# EAGLE design psu (EAGLE 7.7.0)
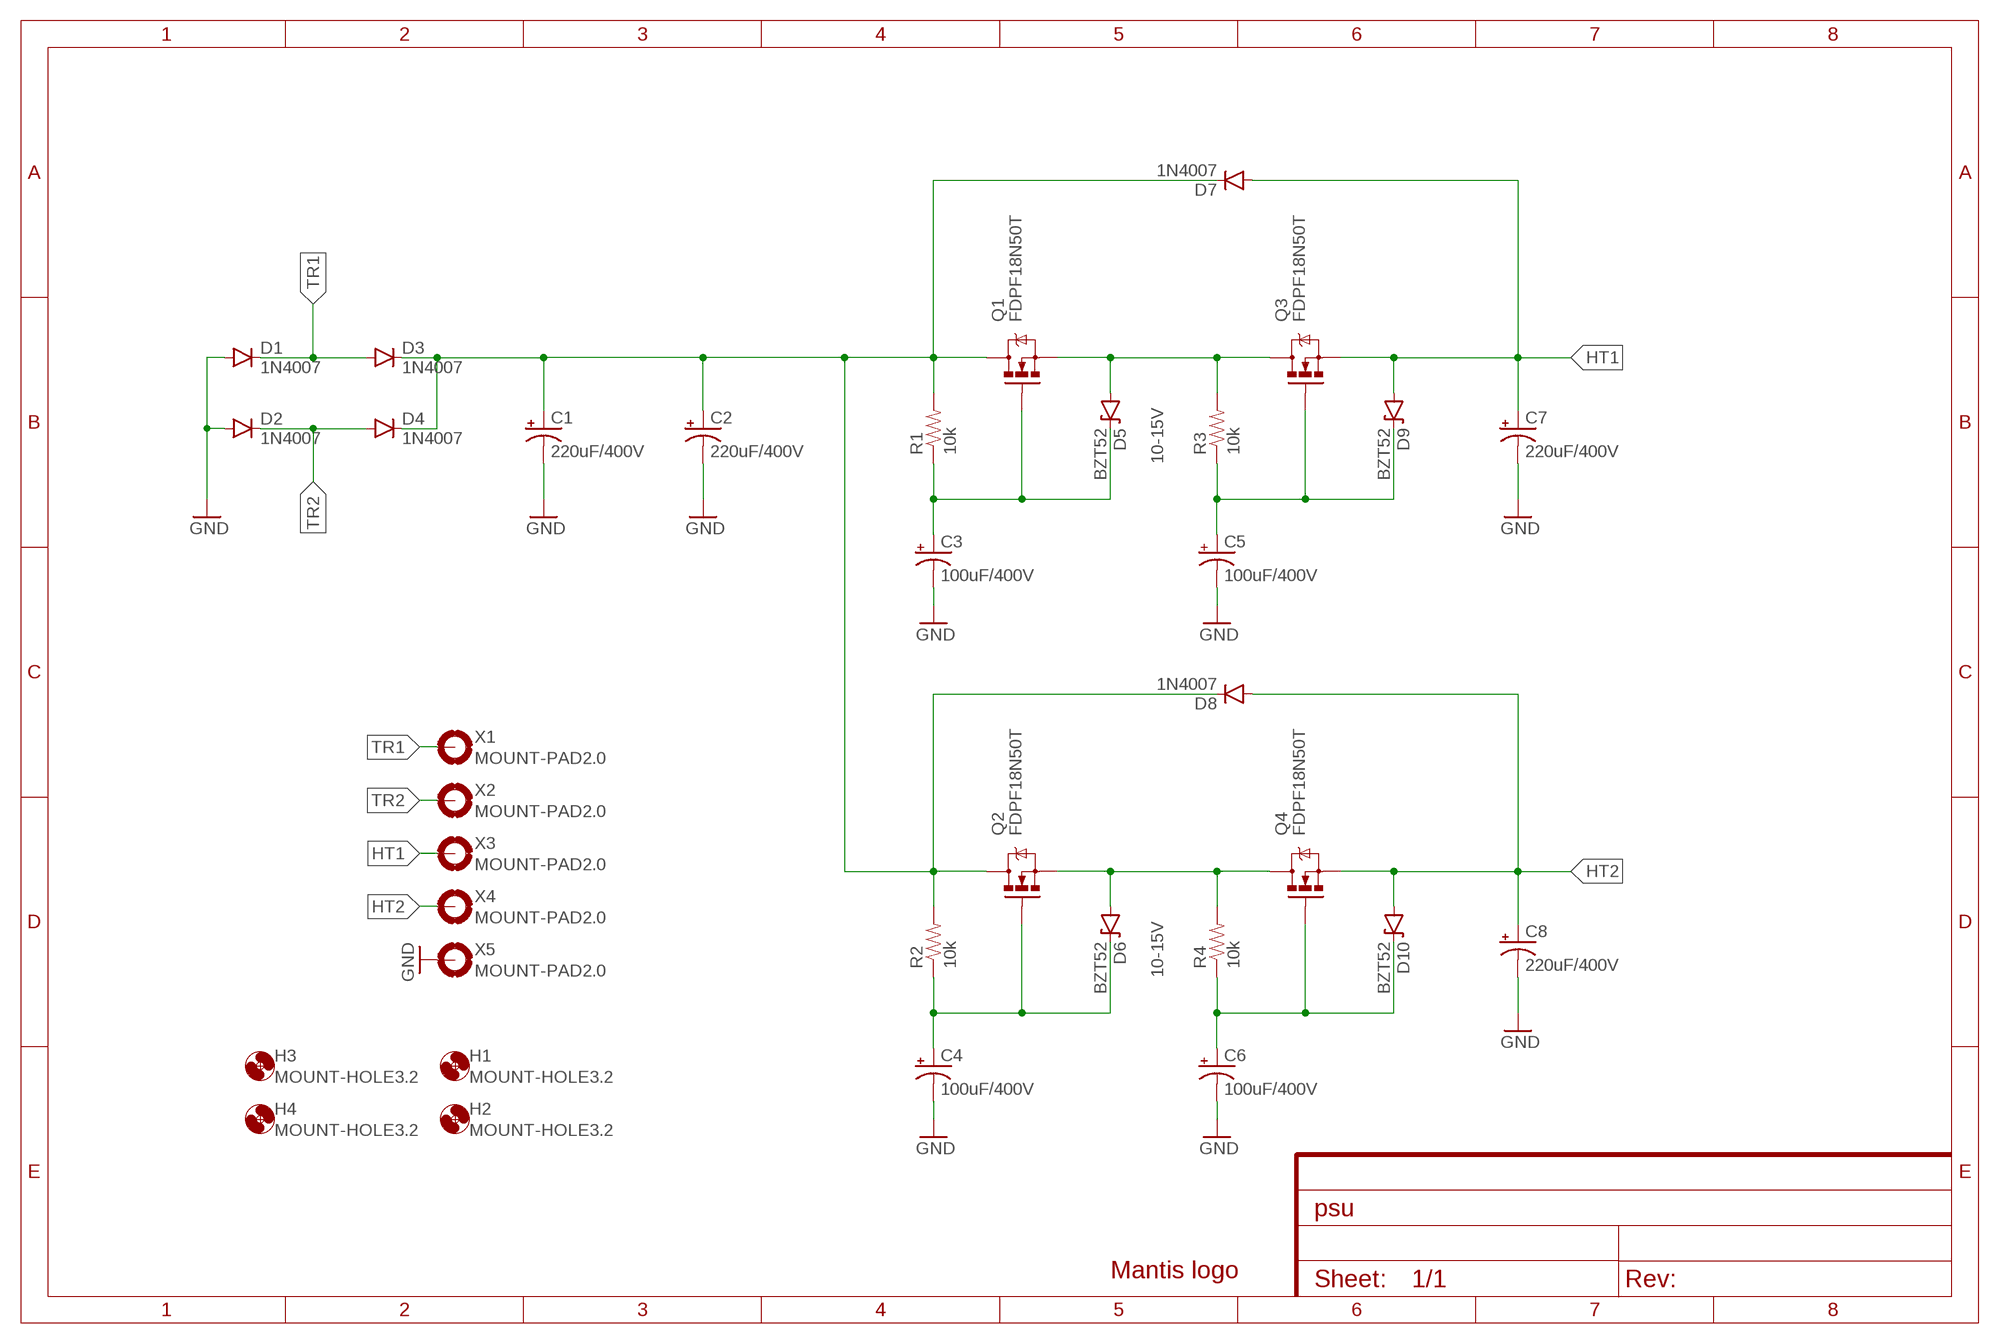
[diagram p0: schematic, sheet 1]

## Parts
C1  220uF/400V  CAP_POLPTH-25/12.5  [CPOL-RADIAL-25/12.5]
C2  220uF/400V  CAP_POLPTH-25/12.5  [CPOL-RADIAL-25/12.5]
C3  100uF/400V  CAP_POLPTH-16/7.5  [CPOL-RADIAL-16/7.5]
C4  100uF/400V  CAP_POLPTH-16/7.5  [CPOL-RADIAL-16/7.5]
C5  100uF/400V  CAP_POLPTH-16/7.5  [CPOL-RADIAL-16/7.5]
C6  100uF/400V  CAP_POLPTH-16/7.5  [CPOL-RADIAL-16/7.5]
C7  220uF/400V  CAP_POLPTH-25/12.5  [CPOL-RADIAL-25/12.5]
C8  220uF/400V  CAP_POLPTH-25/12.5  [CPOL-RADIAL-25/12.5]
D1  1N4007  DIODEPTH  [DIODE-1N4001]
D2  1N4007  DIODEPTH  [DIODE-1N4001]
D3  1N4007  DIODEPTH  [DIODE-1N4001]
D4  1N4007  DIODEPTH  [DIODE-1N4001]
D5  BZT52  DIODE-ZENER  [DIODE-BZT52]
D6  BZT52  DIODE-ZENER  [DIODE-BZT52]
D7  1N4007  DIODEPTH  [DIODE-1N4001]
D8  1N4007  DIODEPTH  [DIODE-1N4001]
D9  BZT52  DIODE-ZENER  [DIODE-BZT52]
D10  BZT52  DIODE-ZENER  [DIODE-BZT52]
H1  MOUNT-HOLE3.2  [3,2]
H2  MOUNT-HOLE3.2  [3,2]
H3  MOUNT-HOLE3.2  [3,2]
H4  MOUNT-HOLE3.2  [3,2]
LOGO1  LOGO-MANTIS  [LOGO-MANTIS]
Q1  FDPF18N50T  [TO220V]
Q2  FDPF18N50T  [TO220V]
Q3  FDPF18N50T  [TO220V]
Q4  FDPF18N50T  [TO220V]
R1  10k  RESISTORPTH-1/4W  [AXIAL-0.4]
R2  10k  RESISTORPTH-1/4W  [AXIAL-0.4]
R3  10k  RESISTORPTH-1/4W  [AXIAL-0.4]
R4  10k  RESISTORPTH-1/4W  [AXIAL-0.4]
X1  MOUNT-PAD2.0  [2.0-PAD]
X2  MOUNT-PAD2.0  [2.0-PAD]
X3  MOUNT-PAD2.0  [2.0-PAD]
X4  MOUNT-PAD2.0  [2.0-PAD]
X5  MOUNT-PAD2.0  [2.0-PAD]

## Nets
GND: C1.2(-) C2.2(-) C3.2(-) C4.2(-) C5.2(-) C6.2(-) C7.2(-) C8.2(-) D1.A D2.A X5.P$1(MOUNT)
HT1: C7.1(+) D7.A D9.A Q3.3(S) X3.P$1(MOUNT)
HT2: C8.1(+) D8.A D10.A Q4.3(S) X4.P$1(MOUNT)
N$1: C1.1(+) C2.1(+) D3.C D4.C D7.C D8.C Q1.2(D) Q2.2(D) R1.P$2 R2.P$2
N$2: C3.1(+) D5.C Q1.1(G) R1.P$1
N$3: D5.A Q1.3(S) Q3.2(D) R3.P$2
N$5: C5.1(+) D9.C Q3.1(G) R3.P$1
N$6: C4.1(+) D6.C Q2.1(G) R2.P$1
N$7: D6.A Q2.3(S) Q4.2(D) R4.P$2
N$8: C6.1(+) D10.C Q4.1(G) R4.P$1
TR1: D1.C D3.A X1.P$1(MOUNT)
TR2: D2.C D4.A X2.P$1(MOUNT)

## Notes on the sheet
- 10-15V
- 10-15V

## Library data of the parts
C1-C8 = my-cap:CAP_POL: Capacitor Polarized These are standard SMD and PTH capacitors. Normally 10uF, 47uF, and 100uF in electrolytic and tantalum varieties. Always verify the external diameter of the through hole cap, it varies with capacity, voltage, and manufacturer. The EIA devices should be standard.
D1-D4 D7 D8 = SparkFun-DiscreteSemi:DIODE: Diode These are standard reverse protection diodes and small signal diodes. SMA package can handle up to about 1A. SOD-323 can handle about 200mA. What the SOD-323 package when ordering, there are some mfgs out there that are 5-pin packages.
D5 D6 D9 D10 = SparkFun-DiscreteSemi:DIODE-ZENER: Zener Diode Production Part - 8199 3.4V Zener Voltage; PROD-ID: DIO-08199
H1-H4 = holes:MOUNT-HOLE: MOUNTING HOLE with drill center marker
LOGO1 = my:LOGO-MANTIS: Mantis logo
Q1-Q4 = my-tran:FDPF18N50T: MOSFET 500V N-Channel PowerTrench MOSFET
R1-R4 = my-res:RESISTOR: Resistor Basic schematic elements and footprints for 0603, 1206, and PTH resistors.
X1-X5 = my-conn:MOUNT-PAD

## Board
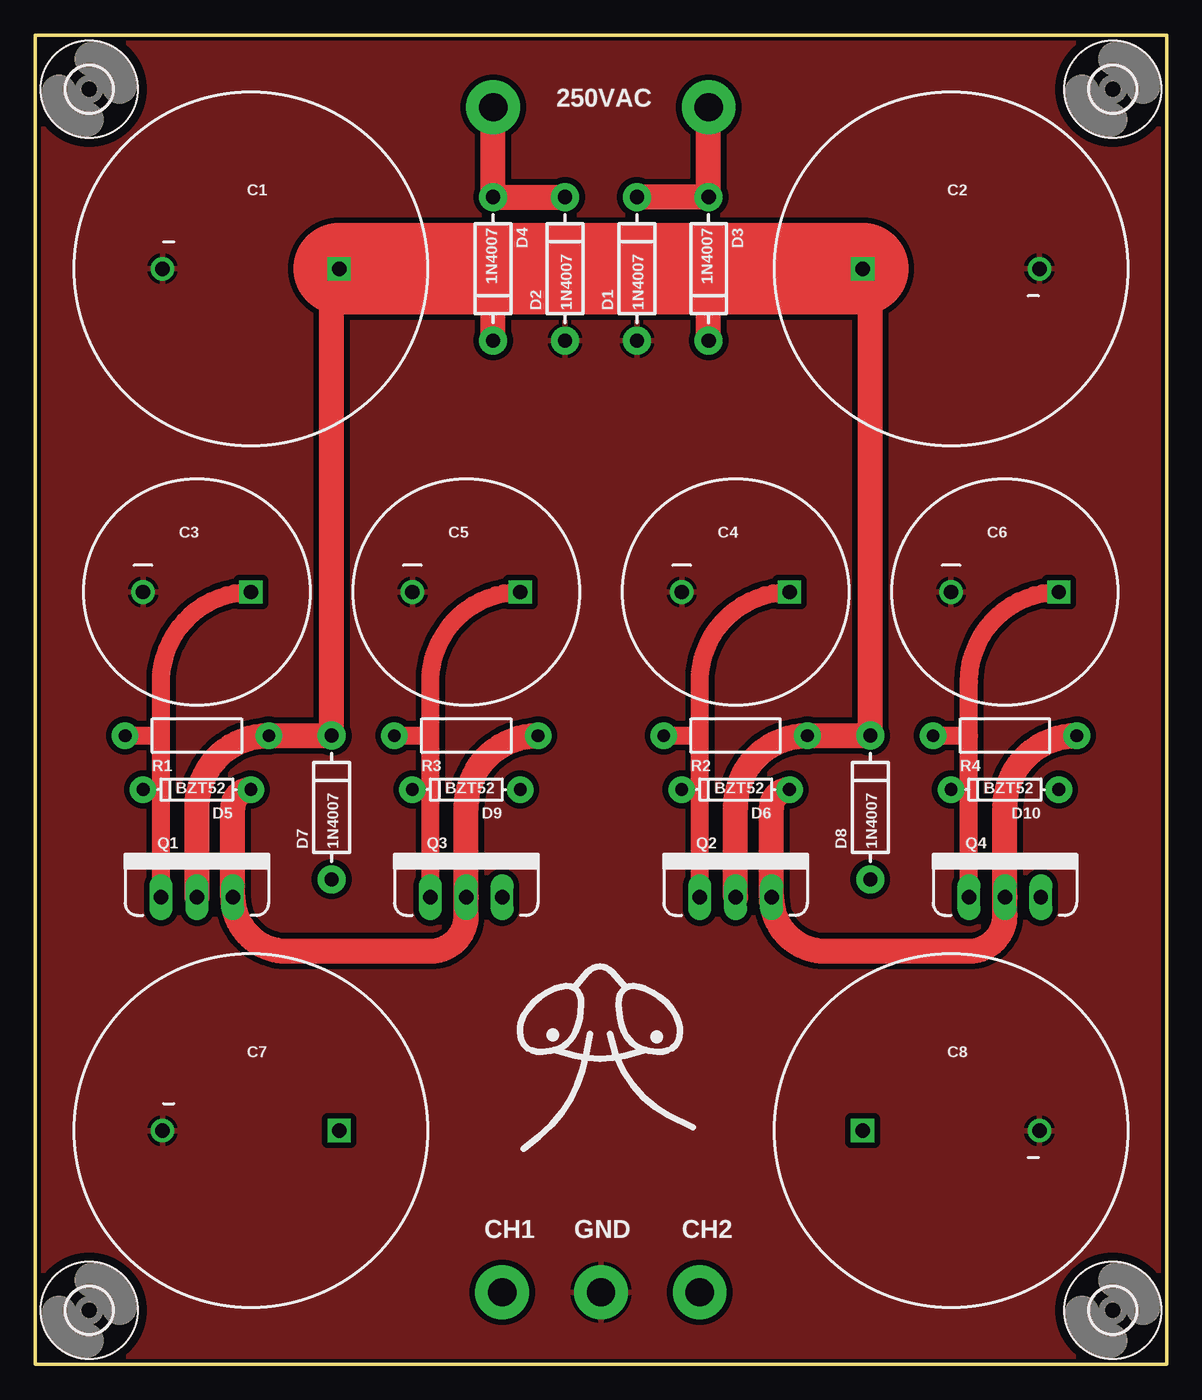
[diagram p1: board, top side]
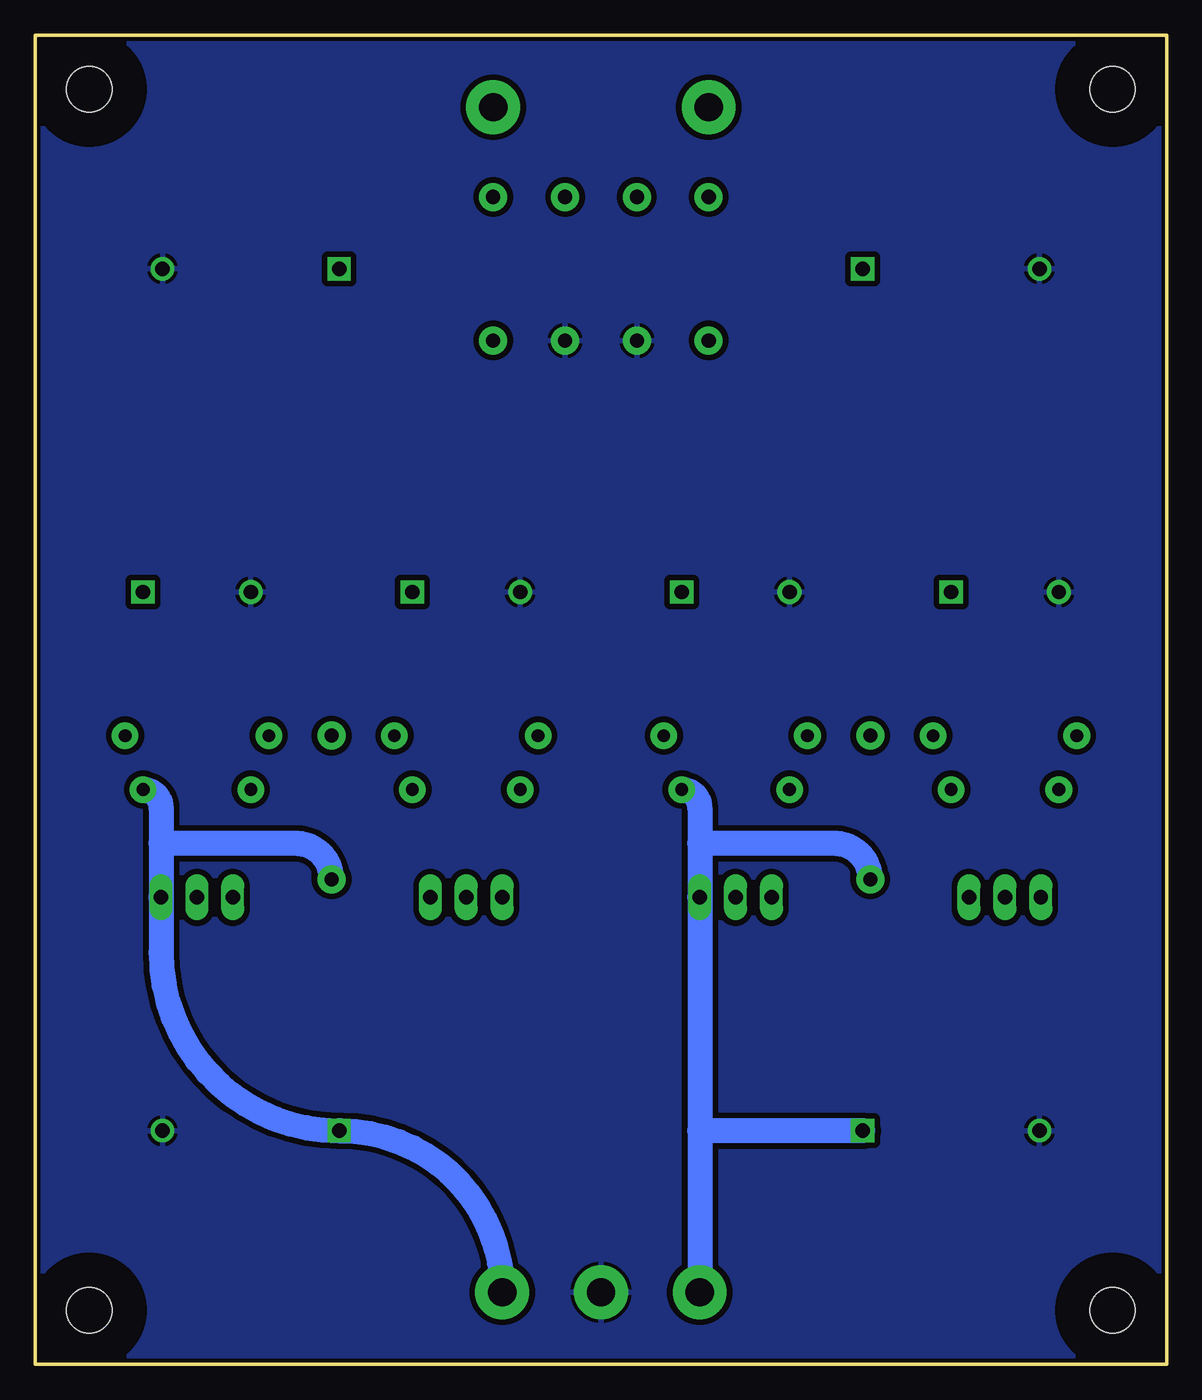
[diagram p2: board, bottom side, seen from below]

Size 80.01 x 93.98 mm. Coordinates in mm from the lower left corner, seen from the top.
Outline: 0,0 80.01,0 80.01,93.98 0,93.98 0,0
Copper layers (1*16): Top 0.035mm / dielectric 1.5mm / Bottom 0.035mm
Design rules "SeeedStudio_2layer_DRU_no_angle_20140221 *": minimum track width 6mil, minimum drill 12mil, track to track 16mil, track to pad 16mil, pad to pad 12mil, via to via 12mil, smd to smd 0mil, copper to edge 10mil, drill to drill 10mil, minimum pad ring 12mil, minimum via ring 10mil, stop-mask expansion 2mil, vias tented up to drill 100mil, thermal gap 10mil

### Footprints (pad centres in the part's own frame; a part is rotated, then mirrored left to right if it is on the bottom)
CPOL-RADIAL-25/12.5 = drill 1.016 pad 1.651 square: 1 6.25,0 | drill 1.016 pad 1.676: 2 -6.25,0
CPOL-RADIAL-16/7.5 = drill 1.016 pad 1.651 square: 1 3.81,0 | drill 1.016 pad 1.676: 2 -3.81,0
DIODE-1N4001 = drill 1 pad 1.981: A -5.08,0; C 5.08,0
DIODE-BZT52 = drill 0.9 pad 1.88: A -3.81,0; C 3.81,0
3,2 = hole 3.2: 0,0
TO220V = drill 1.016 long: 1 -2.54,0; 2 0,0; 3 2.54,0
AXIAL-0.4 = drill 0.9 pad 1.88: P$1 -5.08,0; P$2 5.08,0
2.0-PAD = drill 2 pad 3.81: P$1 0,0

### Placement (x,y rotation side)
C1  15.24,77.47 0 top
C2  64.77,77.47 180 top
C3  11.43,54.61 0 top
C4  49.53,54.61 0 top
C5  30.48,54.61 0 top
C6  68.58,54.61 0 top
C7  15.24,16.51 0 top
C8  64.77,16.51 180 top
D1  42.55,77.47 90 top
D2  37.47,77.47 90 top
D3  47.62,77.47 270 top
D4  32.38,77.47 270 top
D5  11.43,40.64 180 top
D6  49.53,40.64 180 top
D7  20.95,39.37 90 top
D8  59.05,39.37 90 top
D9  30.48,40.64 180 top
D10  68.58,40.64 180 top
H1  76.2,90.17 0 top
H2  3.81,3.81 0 top
H3  3.81,90.17 0 top
H4  76.2,3.81 0 top
LOGO1  40.01,21.59 180 top
Q1  11.43,33.02 0 top
Q2  49.53,33.02 0 top
Q3  30.48,33.02 0 top
Q4  68.58,33.02 0 top
R1  11.43,44.45 0 top
R2  49.53,44.45 0 top
R3  30.48,44.45 0 top
R4  68.58,44.45 0 top
X1  47.62,88.9 0 top
X2  32.38,88.9 0 top
X3  33.02,5.08 0 top
X4  46.99,5.08 0 top
X5  40.01,5.08 0 top

### Tracks (layer width: path | path; a pad name or v marks a point on that pad's centre or on a via)
GND
  pour Bottom: 0,93.98 80.01,93.98 80.01,0 0,0
  pour Top: 0,93.98 80.01,93.98 80.01,0 0,0
HT1
  Bottom 1.778: D9.A arc90 33.02,39.37 33.02,36.83 | 33.02,36.83 Q3.3 33.02,16.51 | 33.02,16.51 X3.P$1 | C7.1 33.02,16.51 | D7.A arc-90 23.5,36.83 33.02,36.83
HT2
  Bottom 1.778: D10.A arc90 71.12,39.37 71.12,36.83 | 71.12,36.83 Q4.3 71.12,29.11 arc-90 C8.1 58.42,16.51 arc90 X4.P$1 | D8.A arc-90 61.59,36.83 71.12,36.83
N$1
  Top 1.778: Q1.2 11.43,39.37 arc-90 R1.P$2 D7.C 20.95,76.94 arc-90 C1.1 | Q2.2 49.53,39.37 arc-90 R2.P$2 D8.C 59.05,76.94 arc90 C2.1 | D4.C 32.38,76.83 arc-90 33.02,77.47 | D3.C 47.62,76.83 arc-90 48.26,77.47
  Top 6.452: C1.1 33.02,77.47 48.26,77.47 C2.1
N$2
  Top 1.27: Q1.1 8.89,40.64 | 8.89,40.64 8.89,44.45 | 8.89,44.45 8.89,48.26 arc-90 C3.1 | R1.P$1 8.89,44.45 | D5.C 8.89,40.64
N$3
  Top 1.778: D5.A arc90 13.97,39.37 Q1.3 arc90 17.78,29.21 27.94,29.21 arc90 30.48,31.75 Q3.2 30.48,39.37 arc-90 R3.P$2
N$5
  Top 1.27: Q3.1 27.94,40.64 | 27.94,40.64 27.94,44.45 | 27.94,44.45 27.94,48.26 arc-90 C5.1 | D9.C 27.94,40.64 | R3.P$1 27.94,44.45
N$6
  Top 1.27: Q2.1 46.99,40.64 | 46.99,40.64 46.99,44.45 | 46.99,44.45 46.99,48.26 arc-90 C4.1 | R2.P$1 46.99,44.45 | D6.C 46.99,40.64
N$7
  Top 1.778: D6.A arc90 52.07,39.37 Q2.3 arc90 55.88,29.21 66.04,29.21 arc90 68.58,31.75 Q4.2 68.58,39.37 arc-90 R4.P$2
N$8
  Top 1.27: Q4.1 66.04,40.64 | 66.04,40.64 66.04,44.45 | 66.04,44.45 66.04,48.26 arc-90 C6.1 | R4.P$1 66.04,44.45 | D10.C 66.04,40.64
TR1
  Top 1.778: D1.C D3.A X1.P$1
TR2
  Top 1.778: D2.C D4.A X2.P$1

### Text on the board
tPlace: 250VAC | CH1 | GND | CH2